# EAGLE design colourMatcher (EAGLE 5.11)
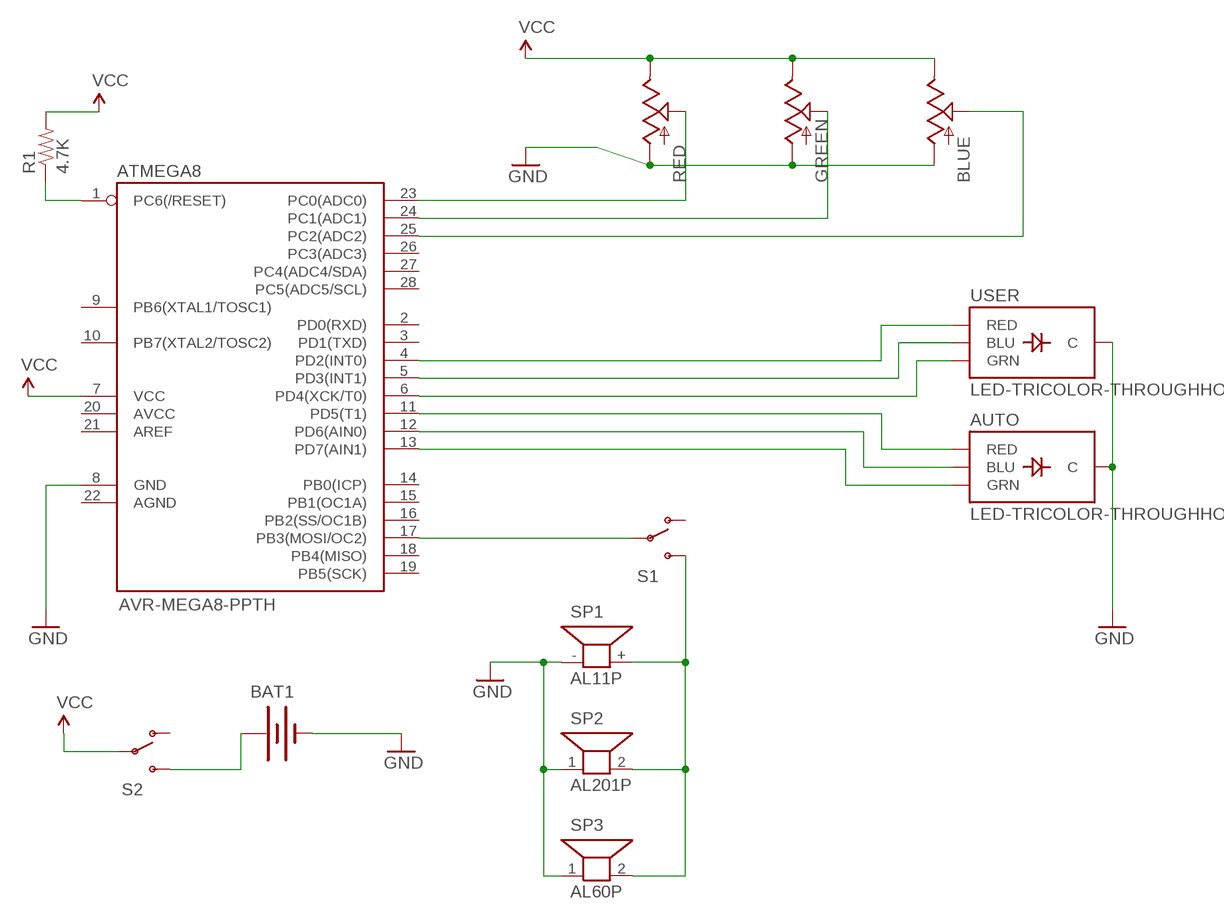
[diagram p0: schematic, sheet 1]

## Parts
ATMEGA8  AVR-MEGA8-PPTH  [DIL28-3]
AUTO  LED-TRICOLOR-THROUGHHOLE  [LED-TRICOLOR-THROUGHHOLE]
BAT1  BATTERY20PTH  [BATTCOM_20MM_PTH]
BLUE  POTTRIM  [TRIM_POT]
GREEN  POTTRIM  [TRIM_POT]
R1  4.7K  RESISTORPTH1  [AXIAL-0.3]
RED  POTTRIM  [TRIM_POT]
S1  SWITCH-SPSTPTH  [SWITCH-SPDT]
S2  SWITCH-SPSTPTH  [SWITCH-SPDT]
SP1  AL11P  [AL11P]
SP2  AL201P  [AL201P]
SP3  AL60P  [AL60P]
USER  LED-TRICOLOR-THROUGHHOLE  [LED-TRICOLOR-THROUGHHOLE]

## Nets
GND: ATMEGA8.8(GND) AUTO.GND(C) BAT1.2(-) BLUE.3(A) GREEN.3(A) RED.3(A) SP1.- SP2.1 SP3.1 USER.GND(C)
N$1: ATMEGA8.23(PC0(ADC0)) RED.1(S)
N$2: ATMEGA8.24(PC1(ADC1)) GREEN.1(S)
N$3: ATMEGA8.25(PC2(ADC2)) BLUE.1(S)
N$4: ATMEGA8.6(PD4(XCK/T0)) USER.GRN
N$5: ATMEGA8.13(PD7(AIN1)) AUTO.GRN
N$6: ATMEGA8.12(PD6(AIN0)) AUTO.BLU
N$7: ATMEGA8.5(PD3(INT1)) USER.BLU
N$8: ATMEGA8.4(PD2(INT0)) USER.RED
N$9: ATMEGA8.11(PD5(T1)) AUTO.RED
N$10: S1.3(S) SP1.+ SP2.2 SP3.2
N$11: ATMEGA8.1(PC6(/RESET)) R1.P$1
N$12: ATMEGA8.17(PB3(MOSI/OC2)) S1.2(P)
N$13: BAT1.1(+) S2.3(S)
VCC: ATMEGA8.7(VCC) BLUE.2(E) GREEN.2(E) R1.P$2 RED.2(E) S2.2(P)
Unconnected: ATMEGA8.2(PD0(RXD)) ATMEGA8.3(PD1(TXD)) ATMEGA8.9(PB6(XTAL1/TOSC1)) ATMEGA8.10(PB7(XTAL2/TOSC2)) ATMEGA8.14(PB0(ICP)) ATMEGA8.15(PB1(OC1A)) ATMEGA8.16(PB2(SS/OC1B)) ATMEGA8.18(PB4(MISO)) ATMEGA8.19(PB5(SCK)) ATMEGA8.20(AVCC) ATMEGA8.21(AREF) ATMEGA8.22(AGND) ATMEGA8.26(PC3(ADC3)) ATMEGA8.27(PC4(ADC4/SDA)) ATMEGA8.28(PC5(ADC5/SCL)) S1.1(O) S2.1(O)

## Library data of the parts
ATMEGA8 = SparkFun:AVR-MEGA8-P: MICROCONTROLLER 8 Kbytes FLASH 1 kbytes SRAM 512 bytes EEPROM USART 4-channel 10 bit ADC 2-channel 8 bit ADC
AUTO USER = SparkFun:LED-TRICOLOR-THROUGHHOLE
BAT1 = SparkFun:BATTERY: Battery Holders Various common sizes : AA, AAA, 20mm coin cell and 12mm coin cell.
BLUE GREEN RED = SparkFun:POT
R1 = SparkFun:RESISTOR: Resistor Basic schematic elements and footprints for 0603, 1206, and PTH 1/10th watt (small) resistors.
S1 S2 = SparkFun:SWITCH-SPST: SPST Switch Simple slide switch. Spark Fun Electronics SKU : COM-00102
SP1 = buzzer:AL11P: SPEAKER Source: Buerklin; OC_FARNELL: unknown; OC_NEWARK: unknown
SP2 = buzzer:AL201P: SPEAKER Source: Buerklin; OC_FARNELL: unknown; OC_NEWARK: unknown
SP3 = buzzer:AL60P: SPEAKER Source: Buerklin; OC_FARNELL: unknown; OC_NEWARK: unknown

## Net classes
0 default: width 0.305 mm, clearance 0.203 mm

## Board
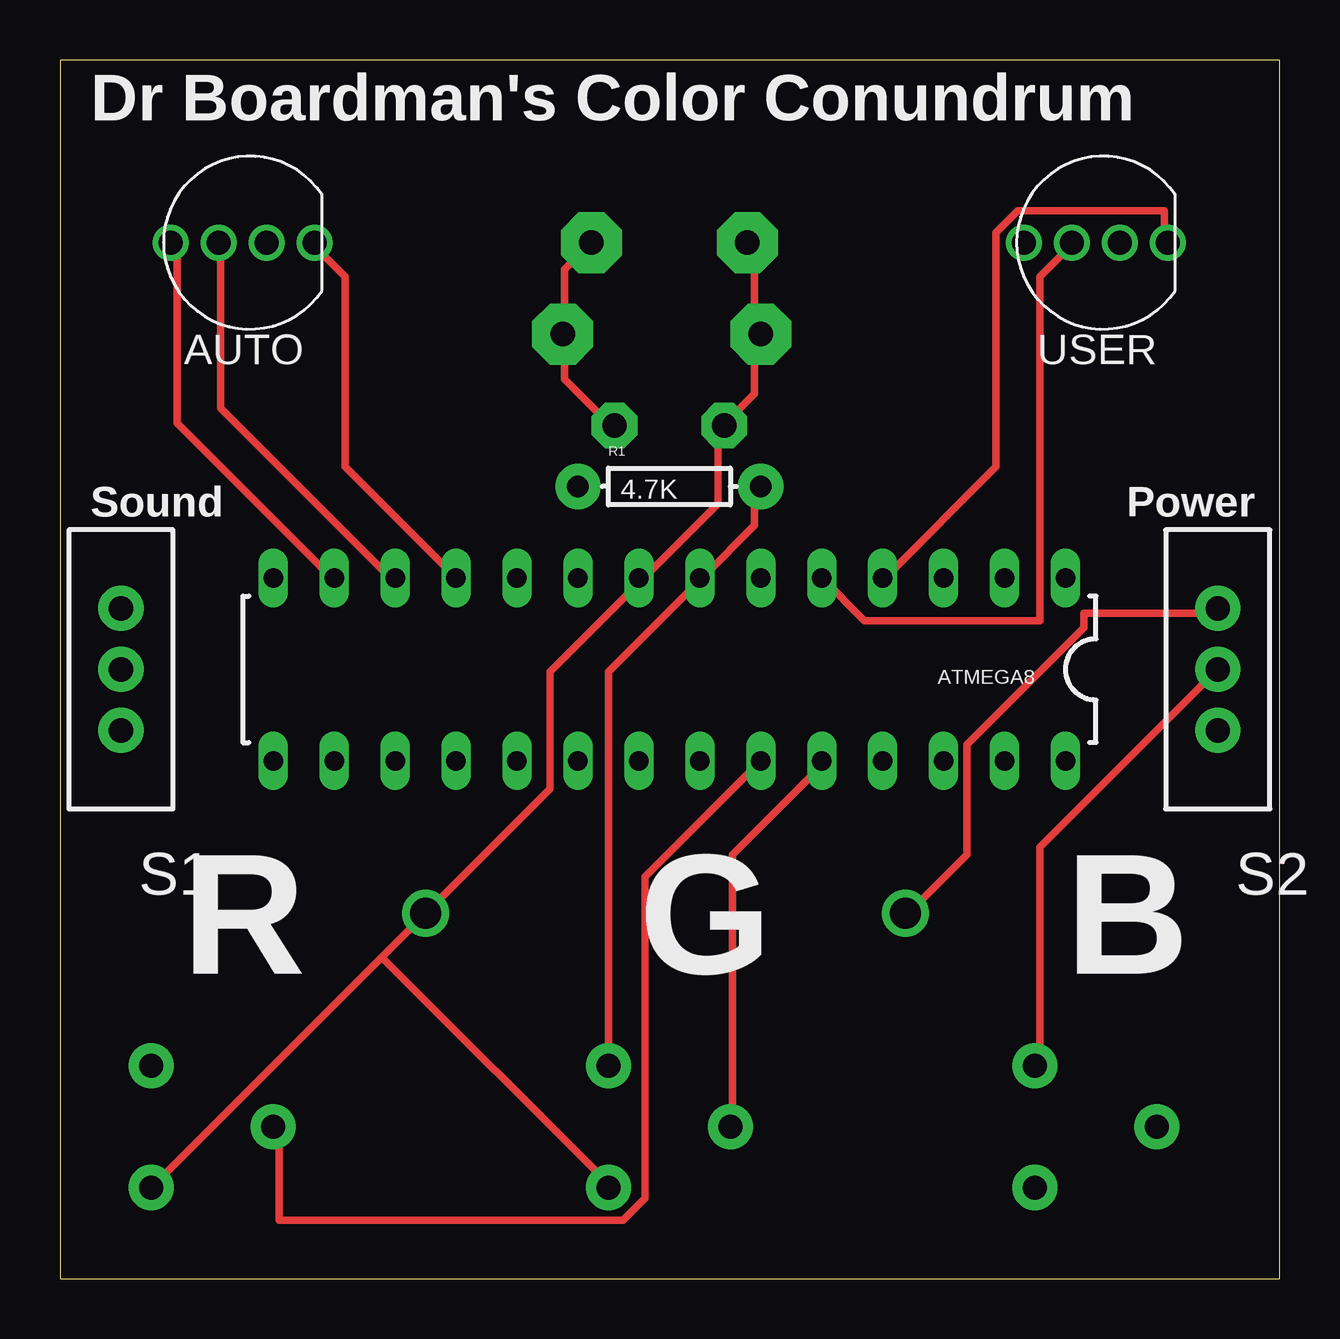
[diagram p1: board, top side]
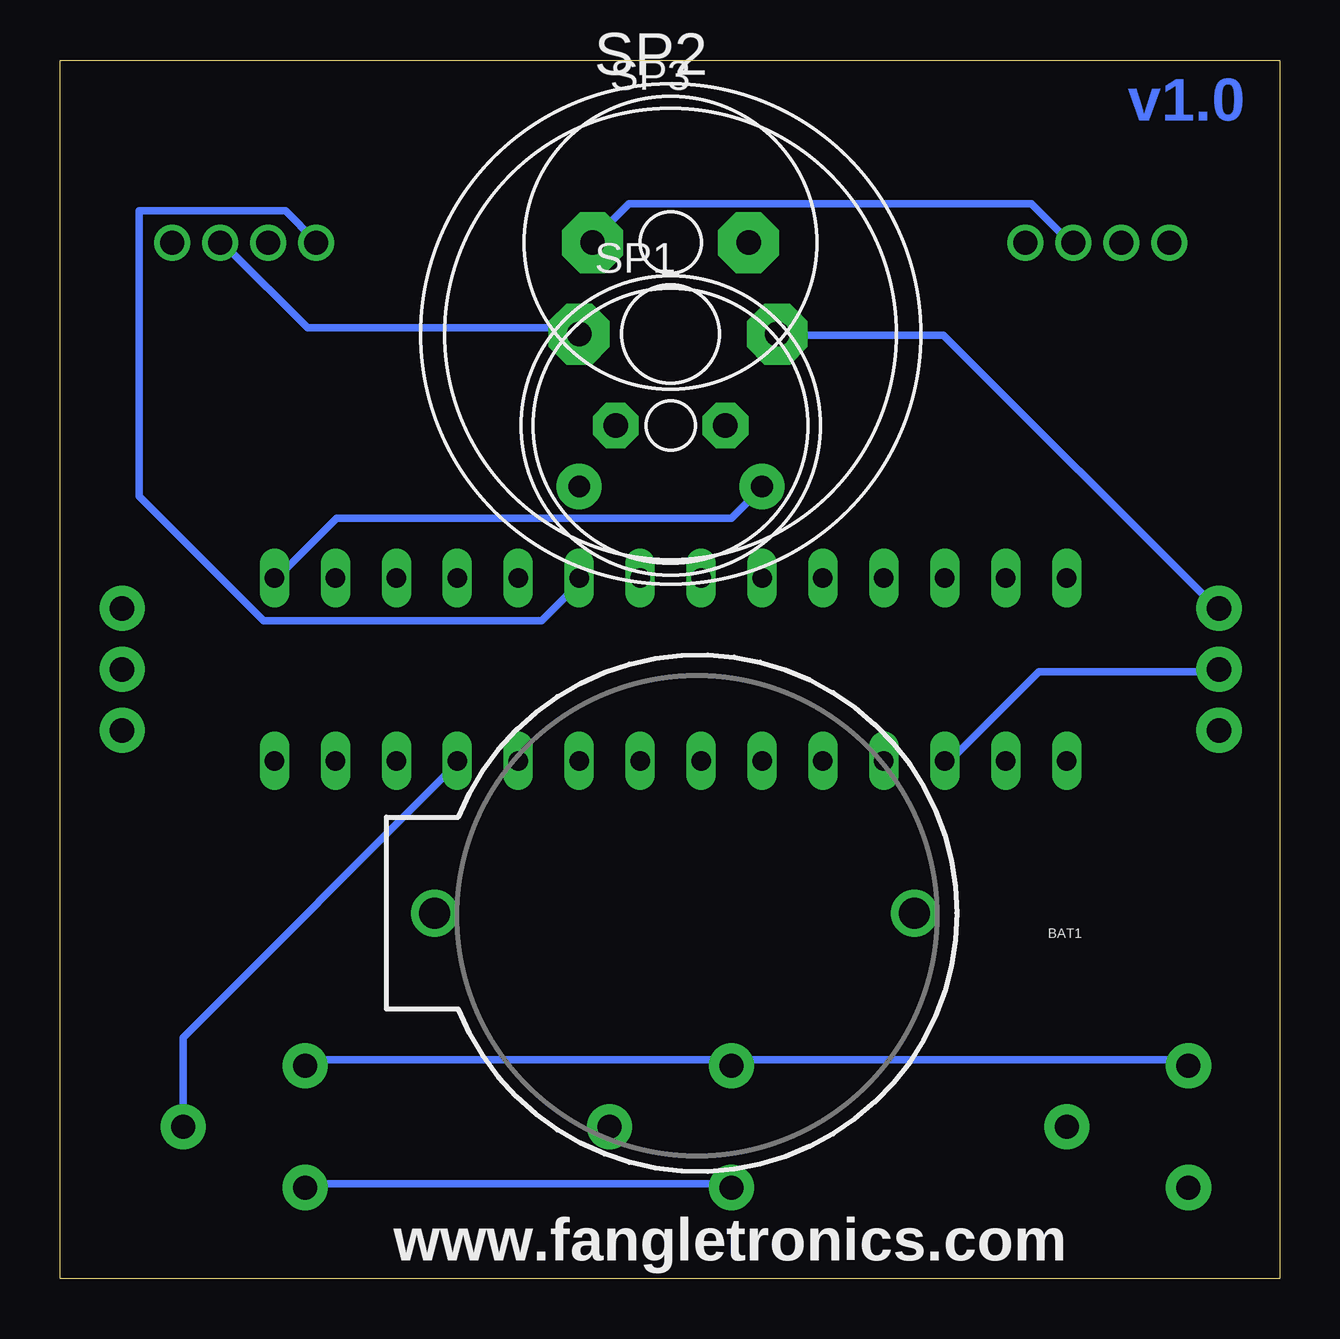
[diagram p2: board, bottom side, seen from below]

Size 50.85 x 50.79 mm. Coordinates in mm from the lower left corner, seen from the top.
Outline: 0,0 50.85,0 50.85,50.79 0,50.79 0,0
Copper layers (1*16): Top 0.0356mm / dielectric 1.5011mm / Bottom 0.0356mm
Design rules "LaenPCBOrder": minimum track width 6mil, minimum drill 13mil, track to track 6mil, track to pad 6mil, pad to pad 6mil, via to via 6mil, smd to smd 6mil, copper to edge 15mil, drill to drill 6mil, minimum pad ring 7mil, minimum via ring 7mil, stop-mask expansion 4mil, vias tented up to drill 0mil, thermal gap 10mil

### Footprints (pad centres in the part's own frame; a part is rotated, then mirrored left to right if it is on the bottom)
DIL28-3 = drill 0.813 long: 1 -16.51,-3.81; 2 -13.97,-3.81; 3 -11.43,-3.81; 4 -8.89,-3.81; 5 -6.35,-3.81; 6 -3.81,-3.81; 7 -1.27,-3.81; 8 1.27,-3.81; 9 3.81,-3.81; 10 6.35,-3.81; 11 8.89,-3.81; 12 11.43,-3.81; 13 13.97,-3.81; 14 16.51,-3.81; 15 16.51,3.81; 16 13.97,3.81; 17 11.43,3.81; 18 8.89,3.81; 19 6.35,3.81; 20 3.81,3.81; 21 1.27,3.81; 22 -1.27,3.81; 23 -3.81,3.81; 24 -6.35,3.81; 25 -8.89,3.81; 26 -11.43,3.81; 27 -13.97,3.81; 28 -16.51,3.81
LED-TRICOLOR-THROUGHHOLE = drill 1 round: BLU 1,0; GND -1,0; GRN 3,0; RED -3,0
BATTCOM_20MM_PTH = drill 1.3 round: 1 20,0; 2 0,0
TRIM_POT = drill 1 pad 1.88 round: 1 5.08,0; 2 0,2.54; 3 0,-2.54
AXIAL-0.3 = drill 0.9 pad 1.88 round: P$1 -3.81,0; P$2 3.81,0
SWITCH-SPDT = drill 1.016 pad 1.88 round: 1 0,2.54; 2 0,0; 3 0,-2.54
AL11P = drill 1.016 pad 1.905 octagon: + 2.286,0; - -2.286,0
AL201P = drill 1.016 pad 2.54 octagon: 1 -3.81,0; 2 4.445,0
AL60P = drill 1.016 pad 2.54 octagon: 1 -3.251,0; 2 3.251,0

### Placement (x,y rotation side)
ATMEGA8  25.4,25.4 180 top
AUTO  7.62,43.18 180 top
BAT1  15.24,15.24 180 bottom
BLUE  40.64,6.35 0 top
GREEN  22.86,6.35 0 top
R1  25.4,33.02 0 top
RED  3.81,6.35 0 top
S1  2.54,25.4 180 top
S2  48.26,25.4 180 top
SP1  25.4,35.56 0 bottom
SP2  25.4,39.37 0 bottom
SP3  25.4,43.18 0 bottom
USER  43.18,43.18 180 top

### Tracks (layer width: path | path; a pad name or v marks a point on that pad's centre or on a via)
GND
  Top 0.305: 13.41,13.41 BAT1.2 20.42,20.42 20.42,25.3 24.08,28.96 ATMEGA8.8 24.38,29.26 27.43,32.31 27.43,35.36 SP1.- 27.74,35.66 28.96,36.88 28.96,39.32 SP2.1 28.96,39.62 28.96,42.67 28.65,42.98 SP3.1 | RED.3 13.41,13.41 | 13.41,13.41 22.86,3.96 GREEN.3
  Bottom 0.305: BLUE.3 40.54,3.96 22.86,3.96 GREEN.3 | AUTO.GND 8.84,43.28 10.36,44.81 27.13,44.81 28.65,43.28 SP3.1 | USER.GND 43.89,42.98 40.54,39.62 29.26,39.62 SP2.1
N$1
  Top 0.305: ATMEGA8.23 24.38,16.76 24.38,3.35 23.47,2.44 9.14,2.44 9.14,6.1 RED.1
N$2
  Top 0.305: ATMEGA8.24 31.7,21.34 28.04,17.68 28.04,6.4 GREEN.1
N$3
  Bottom 0.305: ATMEGA8.25 34.44,21.34 45.72,10.06 BLUE.1
N$4
  Bottom 0.305: ATMEGA8.6 29.26,28.96 30.79,27.43 42.37,27.43 47.55,32.61 47.55,44.5 41.45,44.5 40.23,43.28 USER.GRN
N$5
  Top 0.305: ATMEGA8.13 11.28,29.26 4.88,35.66 4.88,42.98 AUTO.GRN
N$6
  Top 0.305: ATMEGA8.12 13.72,29.26 6.71,36.27 6.71,42.98 AUTO.BLU
N$7
  Top 0.305: ATMEGA8.5 33.53,27.43 40.84,27.43 40.84,41.76 42.06,42.98 USER.BLU
N$8
  Top 0.305: ATMEGA8.4 34.44,29.26 39.01,33.83 39.01,43.59 39.93,44.5 46.02,44.5 46.02,43.28 USER.RED
N$9
  Top 0.305: ATMEGA8.11 11.89,33.83 11.89,41.76 10.67,42.98 AUTO.RED
N$10
  Top 0.305: SP1.+ 22.86,35.66 21.03,37.49 21.03,39.32 SP2.2 21.03,39.62 21.03,42.06 SP3.2
  Bottom 0.305: S1.3 2.74,28.04 14.02,39.32 20.73,39.32 SP2.2
N$11
  Bottom 0.305: ATMEGA8.1 41.76,29.26 39.32,31.7 22.86,31.7 21.64,32.92 R1.P$1
N$12
  Bottom 0.305: ATMEGA8.17 13.72,21.64 10.06,25.3 2.74,25.3 S1.2
N$13
  Top 0.305: S2.3 48.16,27.74 42.67,27.74 42.67,27.13 37.8,22.25 37.8,17.68 35.36,15.24 BAT1.1
VCC
  Top 0.305: R1.P$2 28.96,32.92 28.96,31.39 26.82,29.26 ATMEGA8.7 26.52,28.96 22.86,25.3 GREEN.2 | S2.2 40.84,17.98 40.84,9.14 BLUE.2
  Bottom 0.305: 22.86,9.14 3.96,9.14 RED.2 | 22.86,9.14 40.54,9.14 BLUE.2 | 22.86,9.14 GREEN.2

### Text on the board
Bottom: v1.0
tPlace: Dr Boardman's Color Conundrum | Sound | Power | R | G | B
bPlace: www.fangletronics.com